# Altium schematic sheet Sheet1.SchDoc
size 355 x 304 mm
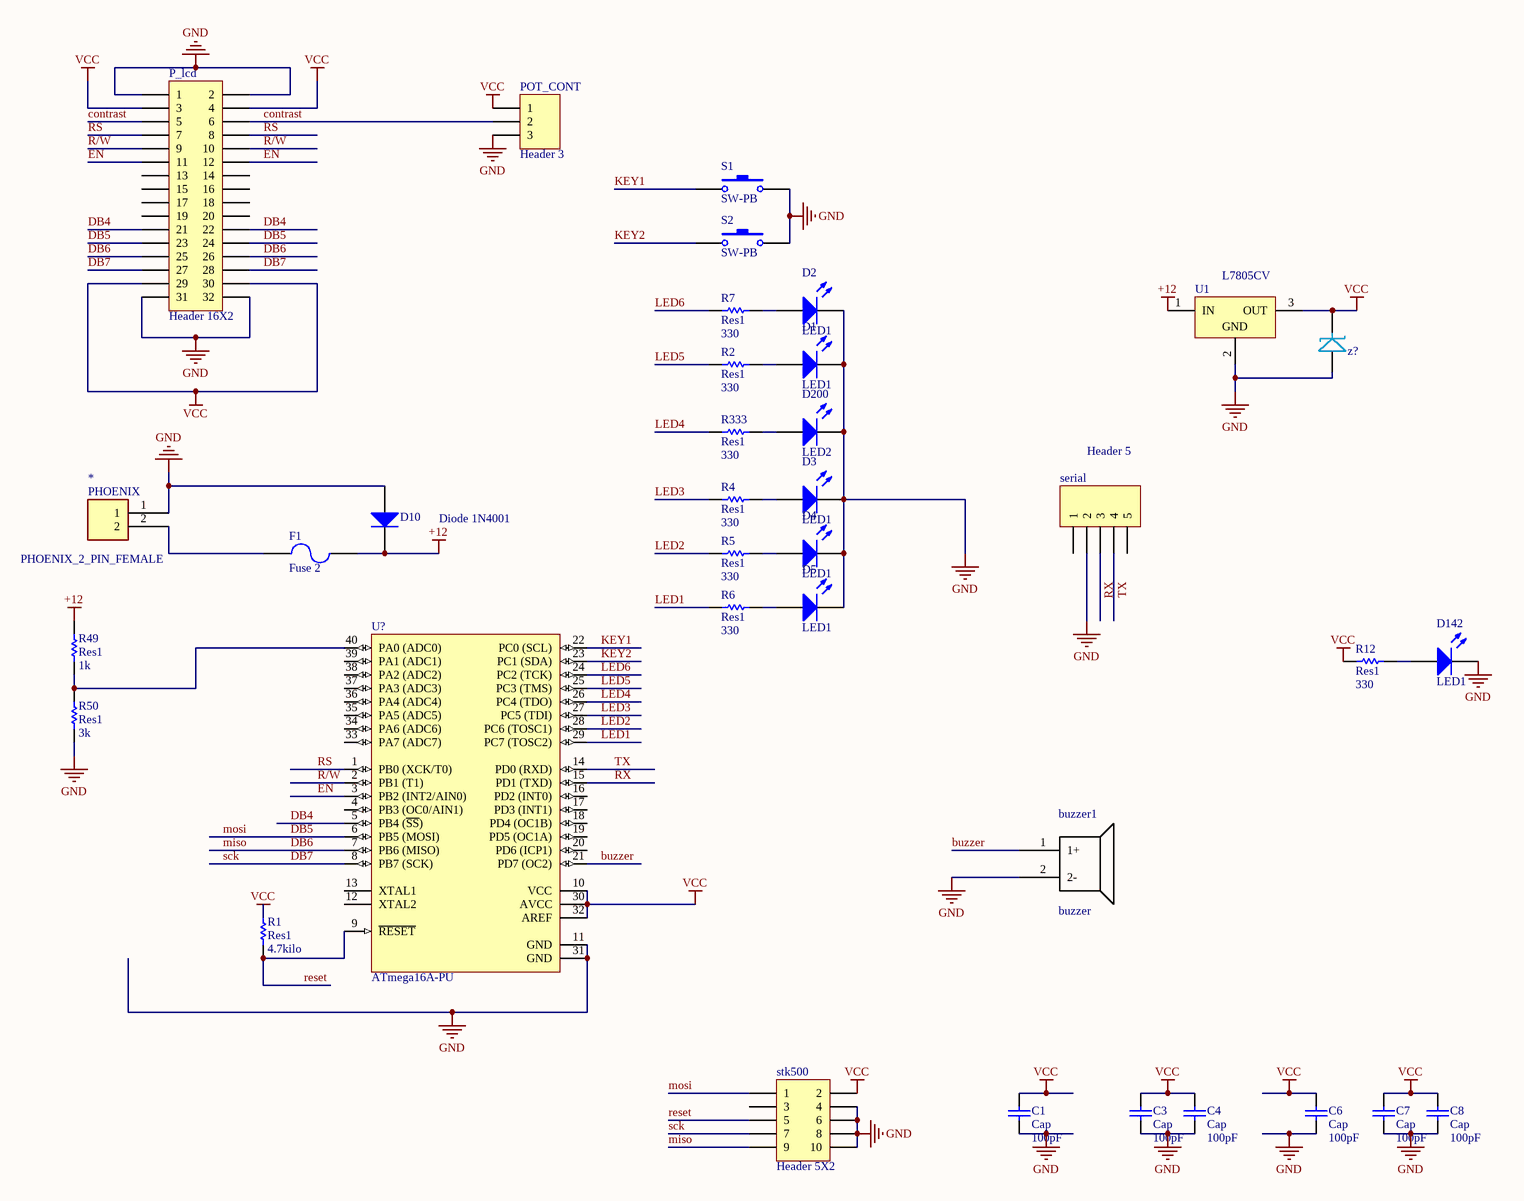
[diagram p0: Sheet1.SchDoc]

## Parts
*  PHOENIX_2_PIN_FEMALE  [PHOENIX_2_PIN_FEMALE]
buzzer1  buzzer  [buzzer]
C1  Cap  value 100pF  [cap1]
C3  Cap  value 100pF  [cap1]
C4  Cap  value 100pF  [cap2]
C6  Cap  value 100pF  [cap2]
C7  Cap  value 100pF  [cap1]
C8  Cap  value 100pF  [cap2]
D1  LED1  [LED-1]
D2  LED1  [LED-1]
D3  LED1  [LED-1]
D4  LED1  [LED-1]
D5  LED1  [LED-1]
D10  Diode 1N4001  [DO-41]
D142  LED1  [LED-1]
D200  LED2  [LED-1]
F1  Fuse 2  [fuse]
P_lcd  Header 16X2  [HDR2X16]
POT_CONT  Header 3  [HDR1X3]
R1  Res1  value 4.7kilo  [AXIAL-0.3]
R2  Res1  value 330  [AXIAL-0.3]
R4  Res1  value 330  [AXIAL-0.3]
R5  Res1  value 330  [AXIAL-0.3]
R6  Res1  value 330  [AXIAL-0.3]
R7  Res1  value 330  [AXIAL-0.3]
R12  Res1  value 330  [AXIAL-0.3]
R49  Res1  value 1k  [AXIAL-0.3]
R50  Res1  value 3k  [AXIAL-0.3]
R333  Res1  value 330  [AXIAL-0.3]
S1  SW-PB  [SPST-2]
S2  SW-PB  [SPST-2]
serial  Header 5  [HDR1X5]
stk500  Header 5X2  [HDR2X5]
U1  L7805CV  [TO220]
U?  ATmega16A-PU  [40P6]
z?  zener diod sod-80  [AXIAL-0.3]  (value not drawn)

## Nets
+12: D10.2(K) F1.2 R49.2 U1.1(IN)
GND: *.1 buzzer1.2(2-) C1.1 C3.1 C4.1 C6.1 C7.1 C8.1 D1.2(K) D2.2(K) D3.2(K) D4.2(K) D5.2(K) D10.1(A) D142.2(K) D200.2(K) P_lcd.1 P_lcd.2 P_lcd.31 P_lcd.32 POT_CONT.3 R50.1 S1.2 S2.2 serial.2 stk500.4 stk500.6 stk500.8 stk500.10 U1.2(GND) U?.11(GND) U?.31(GND) z?.1
VCC: C1.2 C3.2 C4.2 C6.2 C7.2 C8.2 P_lcd.3 P_lcd.4 P_lcd.29 P_lcd.30 POT_CONT.1 R1.2 R12.1 stk500.2 U1.3(OUT) U?.10(VCC) U?.30(AVCC) U?.32(AREF) z?.2
buzzer: buzzer1.1(1+) U?.21(PD7_(OC2))
contrast: P_lcd.5 P_lcd.6 POT_CONT.2
DB4: P_lcd.21 P_lcd.22 U?.5(PB4_(~{SS}))
DB5: P_lcd.23 P_lcd.24 stk500.1 U?.6(PB5_(MOSI))  [also labelled mosi]
DB6: P_lcd.25 P_lcd.26 stk500.9 U?.7(PB6_(MISO))  [also labelled miso]
DB7: P_lcd.27 P_lcd.28 stk500.7 U?.8(PB7_(SCK))  [also labelled sck]
EN: P_lcd.11 P_lcd.12 U?.3(PB2_(INT2/AIN0))
KEY1: S1.1 U?.22(PC0_(SCL))
KEY2: S2.1 U?.23(PC1_(SDA))
LED1: R6.1 U?.29(PC7_(TOSC2))
LED2: R5.1 U?.28(PC6_(TOSC1))
LED3: R4.1 U?.27(PC5_(TDI))
LED4: R333.1 U?.26(PC4_(TDO))
LED5: R2.1 U?.25(PC3_(TMS))
LED6: R7.1 U?.24(PC2_(TCK))
R/W: P_lcd.9 P_lcd.10 U?.2(PB1_(T1))
reset: R1.1 stk500.5 U?.9(~{RESET})
RS: P_lcd.7 P_lcd.8 U?.1(PB0_(XCK/T0))
RX: serial.3 U?.15(PD1_(TXD))
TX: serial.4 U?.14(PD0_(RXD))
Net*_2: *.2 F1.1
NetD1_1: D1.1(A) R2.2
NetD2_1: D2.1(A) R7.2
NetD3_1: D3.1(A) R4.2
NetD4_1: D4.1(A) R5.2
NetD5_1: D5.1(A) R6.2
NetD142_1: D142.1(A) R12.2
NetD200_1: D200.1(A) R333.2
NetR49_1: R49.1 R50.2 U?.40(PA0_(ADC0))

Not connected (* = marked no-connect by the designer): P_lcd 13 14 15 16 17 18 19 20; serial 1 5; stk500 3; U? 4(PB3_(OC0/AIN1)) 12(XTAL2) 13(XTAL1) 16(PD2_(INT0)) 17(PD3_(INT1)) 18(PD4_(OC1B)) 19(PD5_(OC1A)) 20(PD6_(ICP1)) 33(PA7_(ADC7)) 34(PA6_(ADC6)) 35(PA5_(ADC5)) 36(PA4_(ADC4)) 37(PA3_(ADC3)) 38(PA2_(ADC2)) 39(PA1_(ADC1))

## Notes on the sheet
- (in symbol PHOENIX_2_PIN_FEMALE) PHOENIX

## Library data of the parts
C1 C3 C4 C6-C8 = Cap: Capacitor; Published: 8-Jun-2000; LatestRevisionDate: 17-Jul-2002; LatestRevisionNote: Re-released for DXP Platform.; PackageReference: RAD-0.3; Publisher: Altium Limited; PackageDescription: Radial Cap, Thru-Hole; 2 Leads; 0.3 in Pin Spacing
D1-D5 D142 D200 = LED1: Typical RED GaAs LED; Published: 8-Jun-2000; LatestRevisionDate: 08-Jul-2005; LatestRevisionNote: Mech Layer 1 removed.; PackageReference: LED-1; Publisher: Altium Limited; PackageDescription: LED; 2 Leads
D10 = Diode 1N4001: 1 Amp General Purpose Rectifier; Published: 8-Jun-2000; LatestRevisionDate: 17-Jul-2002; LatestRevisionNote: Re-released for DXP Platform.; DatasheetVersion: 1998; PackageVersion: Aug-1999; PackageReference: DO-41; Publisher: Altium Limited; PackageDescription: Diode, Axial; Body 5.2 x 2.7 mm (LxDia. max), Lead Dia. 0.86 mm (max); Code_JEDEC: DO-204-AL; ComponentLink1Description: Manufacturer Link; ComponentLink1URL: http://www.fairchildsemi.com/; ComponentLink2Description: Datasheet; ComponentLink2URL: http://www.fairchildsemi.com/ds/1N%2F1N4001.pdf
F1 = Fuse 2: Fuse; Published: 8-Jun-2000; LatestRevisionDate: 17-Jul-2002; LatestRevisionNote: Re-released for DXP Platform.; PackageReference: PIN-W2/E2.8; Publisher: Altium Limited; PackageDescription: Thru-Hole; 2 Leads
P_lcd = Header 16X2: Header, 16-Pin, Dual row; LatestRevisionDate: 17-Jul-2002; LatestRevisionNote: Re-released for DXP Platform.; Publisher: Altium Limited
POT_CONT = Header 3: Header, 3-Pin; LatestRevisionDate: 17-Jul-2002; LatestRevisionNote: Re-released for DXP Platform.; Publisher: Altium Limited
R1 R2 R4-R7 R12 R49 R50 R333 = Res1: Resistor; Published: 8-Jun-2000; LatestRevisionDate: 17-Jul-2002; LatestRevisionNote: Re-released for DXP Platform.; PackageReference: AXIAL-0.3; Publisher: Altium Limited; PackageDescription: Axial Device, Thru-Hole; 2 Leads; 0.3 in Pin Spacing
S1 S2 = SW-PB: Switch; Published: 24-Mar-1999; LatestRevisionDate: 17-Jul-2002; LatestRevisionNote: Re-released for DXP Platform.; PackageReference: SPST-2; Publisher: Altium Limited; PackageDescription: Switch; 2 Leads
serial = Header 5: Header, 5-Pin; LatestRevisionDate: 17-Jul-2002; LatestRevisionNote: Re-released for DXP Platform.; Publisher: Altium Limited
stk500 = Header 5X2: Header, 5-Pin, Dual row; LatestRevisionDate: 17-Jul-2002; LatestRevisionNote: Re-released for DXP Platform.; Publisher: Altium Limited
U1 = L7805CV: Positive Voltage Regulator, 5V, 3-Pin TO-220; DatasheetVersion: Nov-2011; PackageVersion: ver3.0; PackageReference: TO220; PackageDescription: TO, Thru-Hole, Vertical, Heatsink Mounted; 3 In-Line Leads; Pitch 2.54 mm; PartNumber: L7805CV; ComponentLink1Description: Manufacturer URL; ComponentLink1URL: http://www.st.com; ComponentLink2Description: Datasheet; ComponentLink2URL: http://www.st.com/internet/com/TECHNICAL_RESOURCES/TECHNICAL_LITERATURE/DATASHEET/CD00000444.pdf; ComponentLink3Description: Package Specification; ComponentLink3URL: http://www.st.com/internet/com/TECHNICAL_RESOURCES/TECHNICAL_LITERATURE/PACKAGE_INFORMATION/CD00004649.pdf
U? = ATmega16A-PU: 8-bit AVR Microcontroller, 16KB Flash, 512 Bytes EEPROM, 1KB SRAM, 40-pin PDIP, Industrial Grade (-40°C to 85°C); DatasheetVersion: revB, Jul-2009; PackageVersion: revB, Sep-2001; PackageReference: 40P6; PackageDescription: 40-lead (0.600"/15.24mm Wide) Plastic Dual Inline Package (PDIP); Code_JEDEC: MS-011-AC; ComponentLink1Description: Manufacturer URL; ComponentLink1URL: http://www.atmel.com/; ComponentLink2Description: ATmega16A Datasheet; ComponentLink2URL: http://www.atmel.com/dyn/resources/prod_documents/doc8154.pdf; ComponentLink3Description: ATmega16A Summary; ComponentLink3URL: http://www.atmel.com/dyn/resources/prod_documents/8154S.pdf